# EAGLE schematic untitled (EAGLE 6.2)
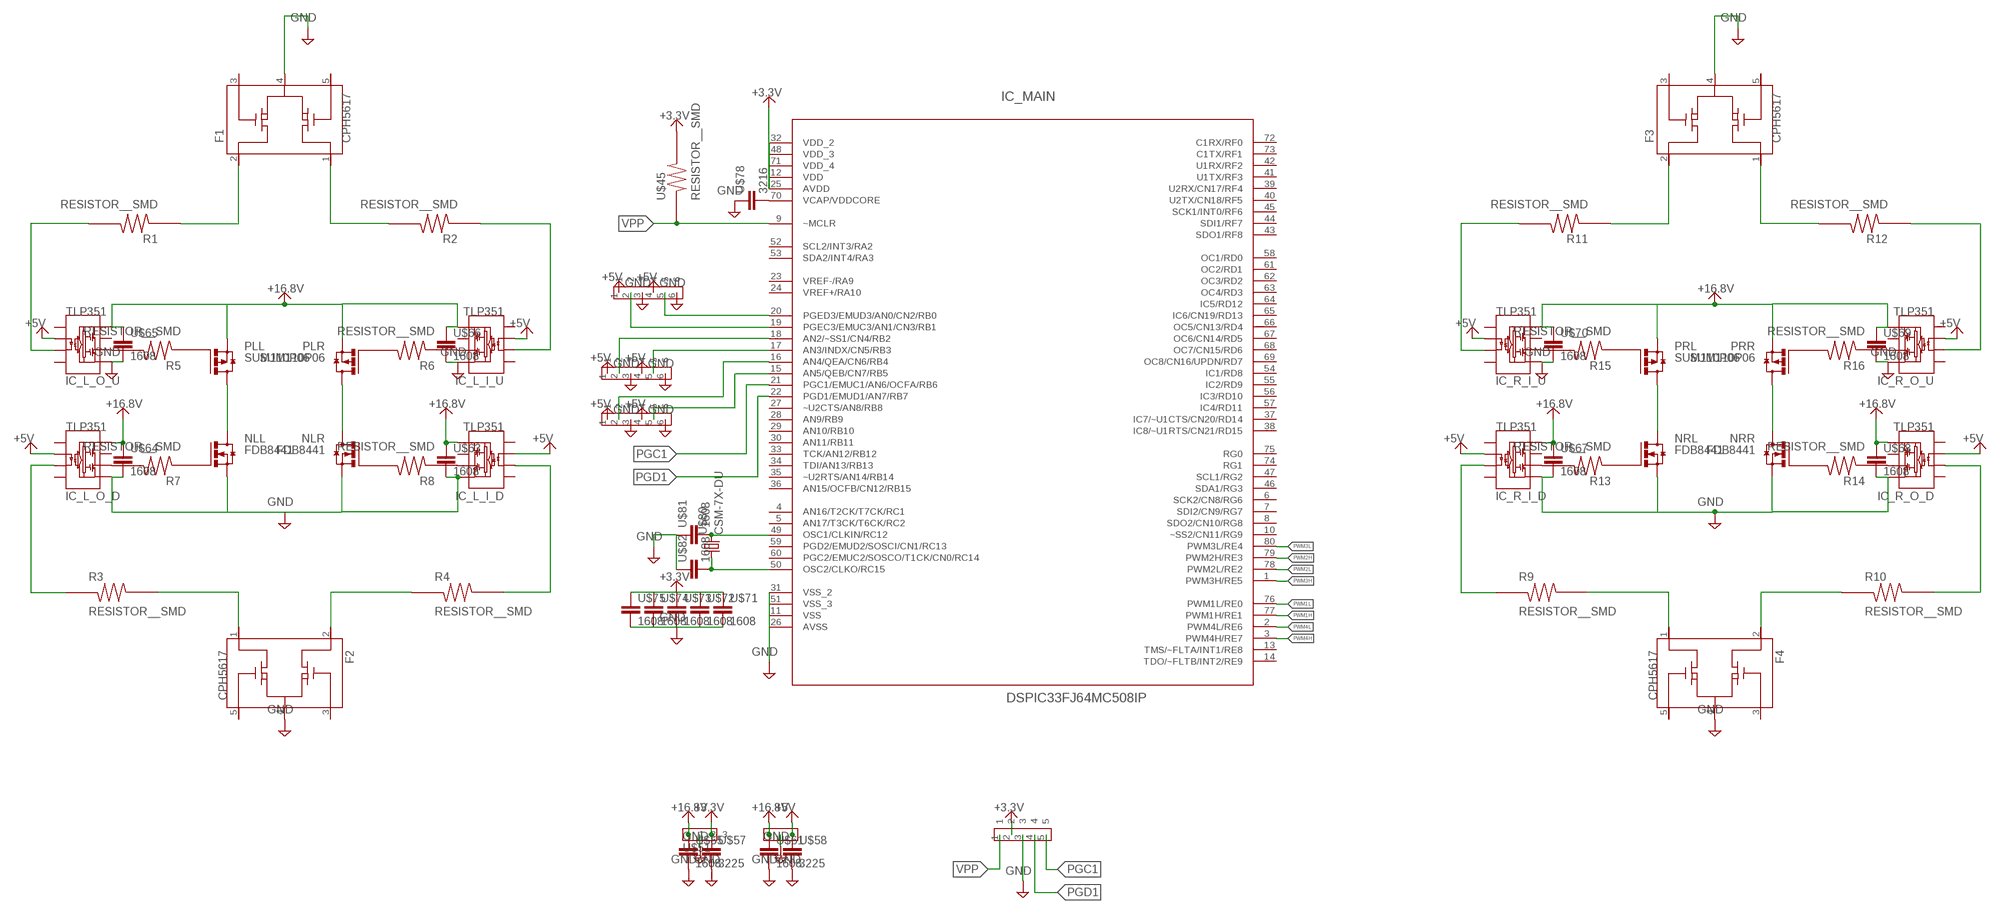
[diagram p0: schematic, sheet 1]

## Parts
F1  CPH5617  [CHP-5]
F2  CPH5617  [CHP-5]
F3  CPH5617  [CHP-5]
F4  CPH5617  [CHP-5]
IC_L_I_D  TLP351  [DIL08]
IC_L_I_U  TLP351  [DIL08]
IC_L_O_D  TLP351  [DIL08]
IC_L_O_U  TLP351  [DIL08]
IC_MAIN  DSPIC33FJ64MC508IP  [QFP50P1400X1400X120-80N]
IC_R_I_D  TLP351  [DIL08]
IC_R_I_U  TLP351  [DIL08]
IC_R_O_D  TLP351  [DIL08]
IC_R_O_U  TLP351  [DIL08]
NLL  FDB8441  [TO-263]
NLR  FDB8441  [TO-263]
NRL  FDB8441  [TO-263]
NRR  FDB8441  [TO-263]
PLL  SUM110P06  [TO-263]
PLR  SUM110P06  [TO-263]
PRL  SUM110P06  [TO-263]
PRR  SUM110P06  [TO-263]
R1  RESISTOR__SMD  [1608]
R2  RESISTOR__SMD  [1608]
R3  RESISTOR__SMD  [1608]
R4  RESISTOR__SMD  [1608]
R5  RESISTOR__SMD  [1608]
R6  RESISTOR__SMD  [1608]
R7  RESISTOR__SMD  [1608]
R8  RESISTOR__SMD  [1608]
R9  RESISTOR__SMD  [1608]
R10  RESISTOR__SMD  [1608]
R11  RESISTOR__SMD  [1608]
R12  RESISTOR__SMD  [1608]
R13  RESISTOR__SMD  [1608]
R14  RESISTOR__SMD  [1608]
R15  RESISTOR__SMD  [1608]
R16  RESISTOR__SMD  [1608]
U$1  PIN_HEADER_5  [PIN_HEADER_5]
U$4  PIN_HEADER_6  [PIN_HEADER_6]
U$5  PIN_HEADER_6  [PIN_HEADER_6]
U$20  PIN_HEADER_6  [PIN_HEADER_6]
U$45  RESISTOR__SMD  [1608]
U$47  TA48M05  [ＨＳＩＰ３]
U$51  TA48M033  [ＨＳＩＰ３]
U$55  1608  [1608]
U$57  3225  [3225]
U$58  3225  [3225]
U$61  1608  [1608]
U$63  1608  [1608]
U$64  1608  [1608]
U$65  1608  [1608]
U$66  1608  [1608]
U$67  1608  [1608]
U$68  1608  [1608]
U$69  1608  [1608]
U$70  1608  [1608]
U$71  1608  [1608]
U$72  1608  [1608]
U$73  1608  [1608]
U$74  1608  [1608]
U$75  1608  [1608]
U$78  3216  [3216]
U$80  CSM-7X-DU  [CSM-7X-DU]
U$81  1608  [1608]
U$82  1608  [1608]

## Nets
+3.3V: IC_MAIN.12(VDD) IC_MAIN.25(AVDD) IC_MAIN.32(VDD_2) IC_MAIN.48(VDD_3) IC_MAIN.71(VDD_4) U$1.2 U$45.2 U$51.3 U$57.P$1 U$71.P$1 U$72.P$1 U$73.P$1 U$74.P$1 U$75.P$1
+5V: IC_L_I_D.2(LED+) IC_L_I_U.2(LED+) IC_L_O_D.2(LED+) IC_L_O_U.2(LED+) IC_R_I_D.2(LED+) IC_R_I_U.2(LED+) IC_R_O_D.2(LED+) IC_R_O_U.2(LED+) U$4.1 U$4.4 U$5.1 U$5.4 U$20.1 U$20.4 U$47.3(OUT) U$58.P$1
+16.8V: IC_L_I_D.8(VDD) IC_L_I_U.8(VDD) IC_L_O_D.8(VDD) IC_L_O_U.8(VDD) IC_R_I_D.8(VDD) IC_R_I_U.8(VDD) IC_R_O_D.8(VDD) IC_R_O_U.8(VDD) PLL.2(S) PLR.2(S) PRL.2(S) PRR.2(S) U$47.1(IN) U$51.1 U$55.P$1 U$61.P$1 U$63.P$1 U$64.P$1 U$65.P$1 U$66.P$1 U$67.P$1 U$68.P$1 U$69.P$1 U$70.P$1
GND: F1.4(S) F2.4(S) F3.4(S) F4.4(S) IC_L_I_D.5(GND) IC_L_I_U.5(GND) IC_L_O_D.5(GND) IC_L_O_U.5(GND) IC_MAIN.11(VSS) IC_MAIN.26(AVSS) IC_MAIN.31(VSS_2) IC_MAIN.51(VSS_3) IC_R_I_D.5(GND) IC_R_I_U.5(GND) IC_R_O_D.5(GND) IC_R_O_U.5(GND) NLL.2(S) NLR.2(S) NRL.2(S) NRR.2(S) U$1.3 U$4.3 U$4.6 U$5.3 U$5.6 U$20.3 U$20.6 U$47.2(GND) U$51.2 U$55.P$2 U$57.P$2 U$58.P$2 U$61.P$2 U$63.P$2 U$64.P$2 U$65.P$2 U$66.P$2 U$67.P$2 U$68.P$2 U$69.P$2 U$70.P$2 U$71.P$2 U$72.P$2 U$73.P$2 U$74.P$2 U$75.P$2 U$78.P$1 U$81.P$1 U$82.P$1
N$1: F2.2(D2) R4.1
N$2: F2.1(D1) R3.2
N$3: IC_L_O_D.3(LED-) R3.1
N$4: IC_L_I_D.3(LED-) R4.2
N$5: IC_MAIN.19(PGEC3/EMUC3/AN1/CN3/RB1) U$4.2
N$6: IC_MAIN.49(OSC1/CLKIN/RC12) U$80.2 U$81.P$2
N$7: F1.2(D2) R1.1
N$8: F1.1(D1) R2.2
N$9: NLL.1(G) R7.1
N$10: NLR.1(G) R8.2
N$11: IC_L_O_D.6(OUT) R7.2
N$12: NLL.3(D) PLL.3(D)
N$13: NLR.3(D) PLR.3(D)
N$14: IC_L_I_D.6(OUT) R8.1
N$15: PLL.1(G) R5.1
N$16: IC_L_O_U.6(OUT) R5.2
N$17: IC_L_O_U.3(LED-) R1.2
N$18: IC_L_I_U.3(LED-) R2.1
N$19: IC_MAIN.20(PGED3/EMUD3/AN0/CN2/RB0) U$4.5
N$20: IC_MAIN.18(AN2/~SS1/CN4/RB2) U$5.2
N$21: PLR.1(G) R6.2
N$22: IC_L_I_U.6(OUT) R6.1
N$23: NRL.3(D) PRL.3(D)
N$24: NRR.3(D) PRR.3(D)
N$25: IC_R_I_D.3(LED-) R9.1
N$26: IC_R_O_D.3(LED-) R10.2
N$27: IC_MAIN.17(AN3/INDX/CN5/RB3) U$5.5
N$28: IC_MAIN.16(AN4/QEA/CN6/RB4) U$20.2
N$29: IC_R_I_U.3(LED-) R11.2
N$30: IC_R_O_U.3(LED-) R12.1
N$31: IC_MAIN.15(AN5/QEB/CN7/RB5) U$20.5
N$32: IC_MAIN.50(OSC2/CLKO/RC15) U$80.1 U$82.P$2
N$33: F4.2(D2) R10.1
N$34: F4.1(D1) R9.2
N$35: F3.2(D2) R11.1
N$36: F3.1(D1) R12.2
N$37: NRL.1(G) R13.1
N$38: IC_R_I_D.6(OUT) R13.2
N$39: NRR.1(G) R14.2
N$40: IC_R_O_D.6(OUT) R14.1
N$41: PRL.1(G) R15.1
N$42: IC_R_I_U.6(OUT) R15.2
N$43: PRR.1(G) R16.2
N$44: IC_R_O_U.6(OUT) R16.1
N$45: IC_MAIN.70(VCAP/VDDCORE) U$78.P$2
PGC1: IC_MAIN.21(PGC1/EMUC1/AN6/OCFA/RB6) U$1.5
PGD1: IC_MAIN.22(PGD1/EMUD1/AN7/RB7) U$1.4
PWM1H: IC_MAIN.77(PWM1H/RE1)
PWM1L: IC_MAIN.76(PWM1L/RE0)
PWM2H: IC_MAIN.79(PWM2H/RE3)
PWM2L: IC_MAIN.78(PWM2L/RE2)
PWM3H: IC_MAIN.1(PWM3H/RE5)
PWM3L: IC_MAIN.80(PWM3L/RE4)
PWM4H: IC_MAIN.3(PWM4H/RE7)
PWM4L: IC_MAIN.2(PWM4L/RE6)
VPP: IC_MAIN.9(~MCLR) U$1.1 U$45.1
Unconnected: F1.3(G2) F1.5(G1) F2.3(G2) F2.5(G1) F3.3(G2) F3.5(G1) F4.3(G2) F4.5(G1) IC_L_I_D.1(NC1) IC_L_I_D.4(NC4) IC_L_I_D.7(NC7) IC_L_I_U.1(NC1) IC_L_I_U.4(NC4) IC_L_I_U.7(NC7) IC_L_O_D.1(NC1) IC_L_O_D.4(NC4) IC_L_O_D.7(NC7) IC_L_O_U.1(NC1) IC_L_O_U.4(NC4) IC_L_O_U.7(NC7) IC_MAIN.4(AN16/T2CK/T7CK/RC1) IC_MAIN.5(AN17/T3CK/T6CK/RC2) IC_MAIN.6(SCK2/CN8/RG6) IC_MAIN.7(SDI2/CN9/RG7) IC_MAIN.8(SDO2/CN10/RG8) IC_MAIN.10(~SS2/CN11/RG9) IC_MAIN.13(TMS/~FLTA/INT1/RE8) IC_MAIN.14(TDO/~FLTB/INT2/RE9) IC_MAIN.23(VREF-/RA9) IC_MAIN.24(VREF+/RA10) IC_MAIN.27(~U2CTS/AN8/RB8) IC_MAIN.28(AN9/RB9) IC_MAIN.29(AN10/RB10) IC_MAIN.30(AN11/RB11) IC_MAIN.33(TCK/AN12/RB12) IC_MAIN.34(TDI/AN13/RB13) IC_MAIN.35(~U2RTS/AN14/RB14) IC_MAIN.36(AN15/OCFB/CN12/RB15) IC_MAIN.37(IC7/~U1CTS/CN20/RD14) IC_MAIN.38(IC8/~U1RTS/CN21/RD15) IC_MAIN.39(U2RX/CN17/RF4) IC_MAIN.40(U2TX/CN18/RF5) IC_MAIN.41(U1TX/RF3) IC_MAIN.42(U1RX/RF2) IC_MAIN.43(SDO1/RF8) IC_MAIN.44(SDI1/RF7) IC_MAIN.45(SCK1/INT0/RF6) IC_MAIN.46(SDA1/RG3) IC_MAIN.47(SCL1/RG2) IC_MAIN.52(SCL2/INT3/RA2) IC_MAIN.53(SDA2/INT4/RA3) IC_MAIN.54(IC1/RD8) IC_MAIN.55(IC2/RD9) IC_MAIN.56(IC3/RD10) IC_MAIN.57(IC4/RD11) IC_MAIN.58(OC1/RD0) IC_MAIN.59(PGD2/EMUD2/SOSCI/CN1/RC13) IC_MAIN.60(PGC2/EMUC2/SOSCO/T1CK/CN0/RC14) IC_MAIN.61(OC2/RD1) IC_MAIN.62(OC3/RD2) IC_MAIN.63(OC4/RD3) IC_MAIN.64(IC5/RD12) IC_MAIN.65(IC6/CN19/RD13) IC_MAIN.66(OC5/CN13/RD4) IC_MAIN.67(OC6/CN14/RD5) IC_MAIN.68(OC7/CN15/RD6) IC_MAIN.69(OC8/CN16/UPDN/RD7) IC_MAIN.72(C1RX/RF0) IC_MAIN.73(C1TX/RF1) IC_MAIN.74(RG1) IC_MAIN.75(RG0) IC_R_I_D.1(NC1) IC_R_I_D.4(NC4) IC_R_I_D.7(NC7) IC_R_I_U.1(NC1) IC_R_I_U.4(NC4) IC_R_I_U.7(NC7) IC_R_O_D.1(NC1) IC_R_O_D.4(NC4) IC_R_O_D.7(NC7) IC_R_O_U.1(NC1) IC_R_O_U.4(NC4) IC_R_O_U.7(NC7)

## Library data of the parts
F1-F4 = 06_FET:CPH5617
IC_L_I_D IC_L_I_U IC_L_O_D IC_L_O_U IC_R_I_D IC_R_I_U IC_R_O_D IC_R_O_U = 04_IC:TLP351
IC_MAIN = 07_PIC:DSPIC33FJ64MC508IP
NLL NLR NRL NRR = 06_FET:FDB8441
PLL PLR PRL PRR = 06_FET:SUM110P06
R1-R16 U$45 = 01_R:RESISTOR__SMD
U$1 = 08_CONECTOR:PIN_HEADER_5
U$4 U$5 U$20 = 08_CONECTOR:PIN_HEADER_6
U$47 = 04_IC:TA48M05
U$51 = 04_IC:TA48M033
U$55 U$61 U$63-U$75 U$81 U$82 = 02_C:1608
U$57 U$58 = 02_C:3225
U$78 = 02_C:3216
U$80 = CRYSTAL:CSM-7X-DU